# Altium schematic sheet 瓦力驱动主控原理图.SchDoc
size A2
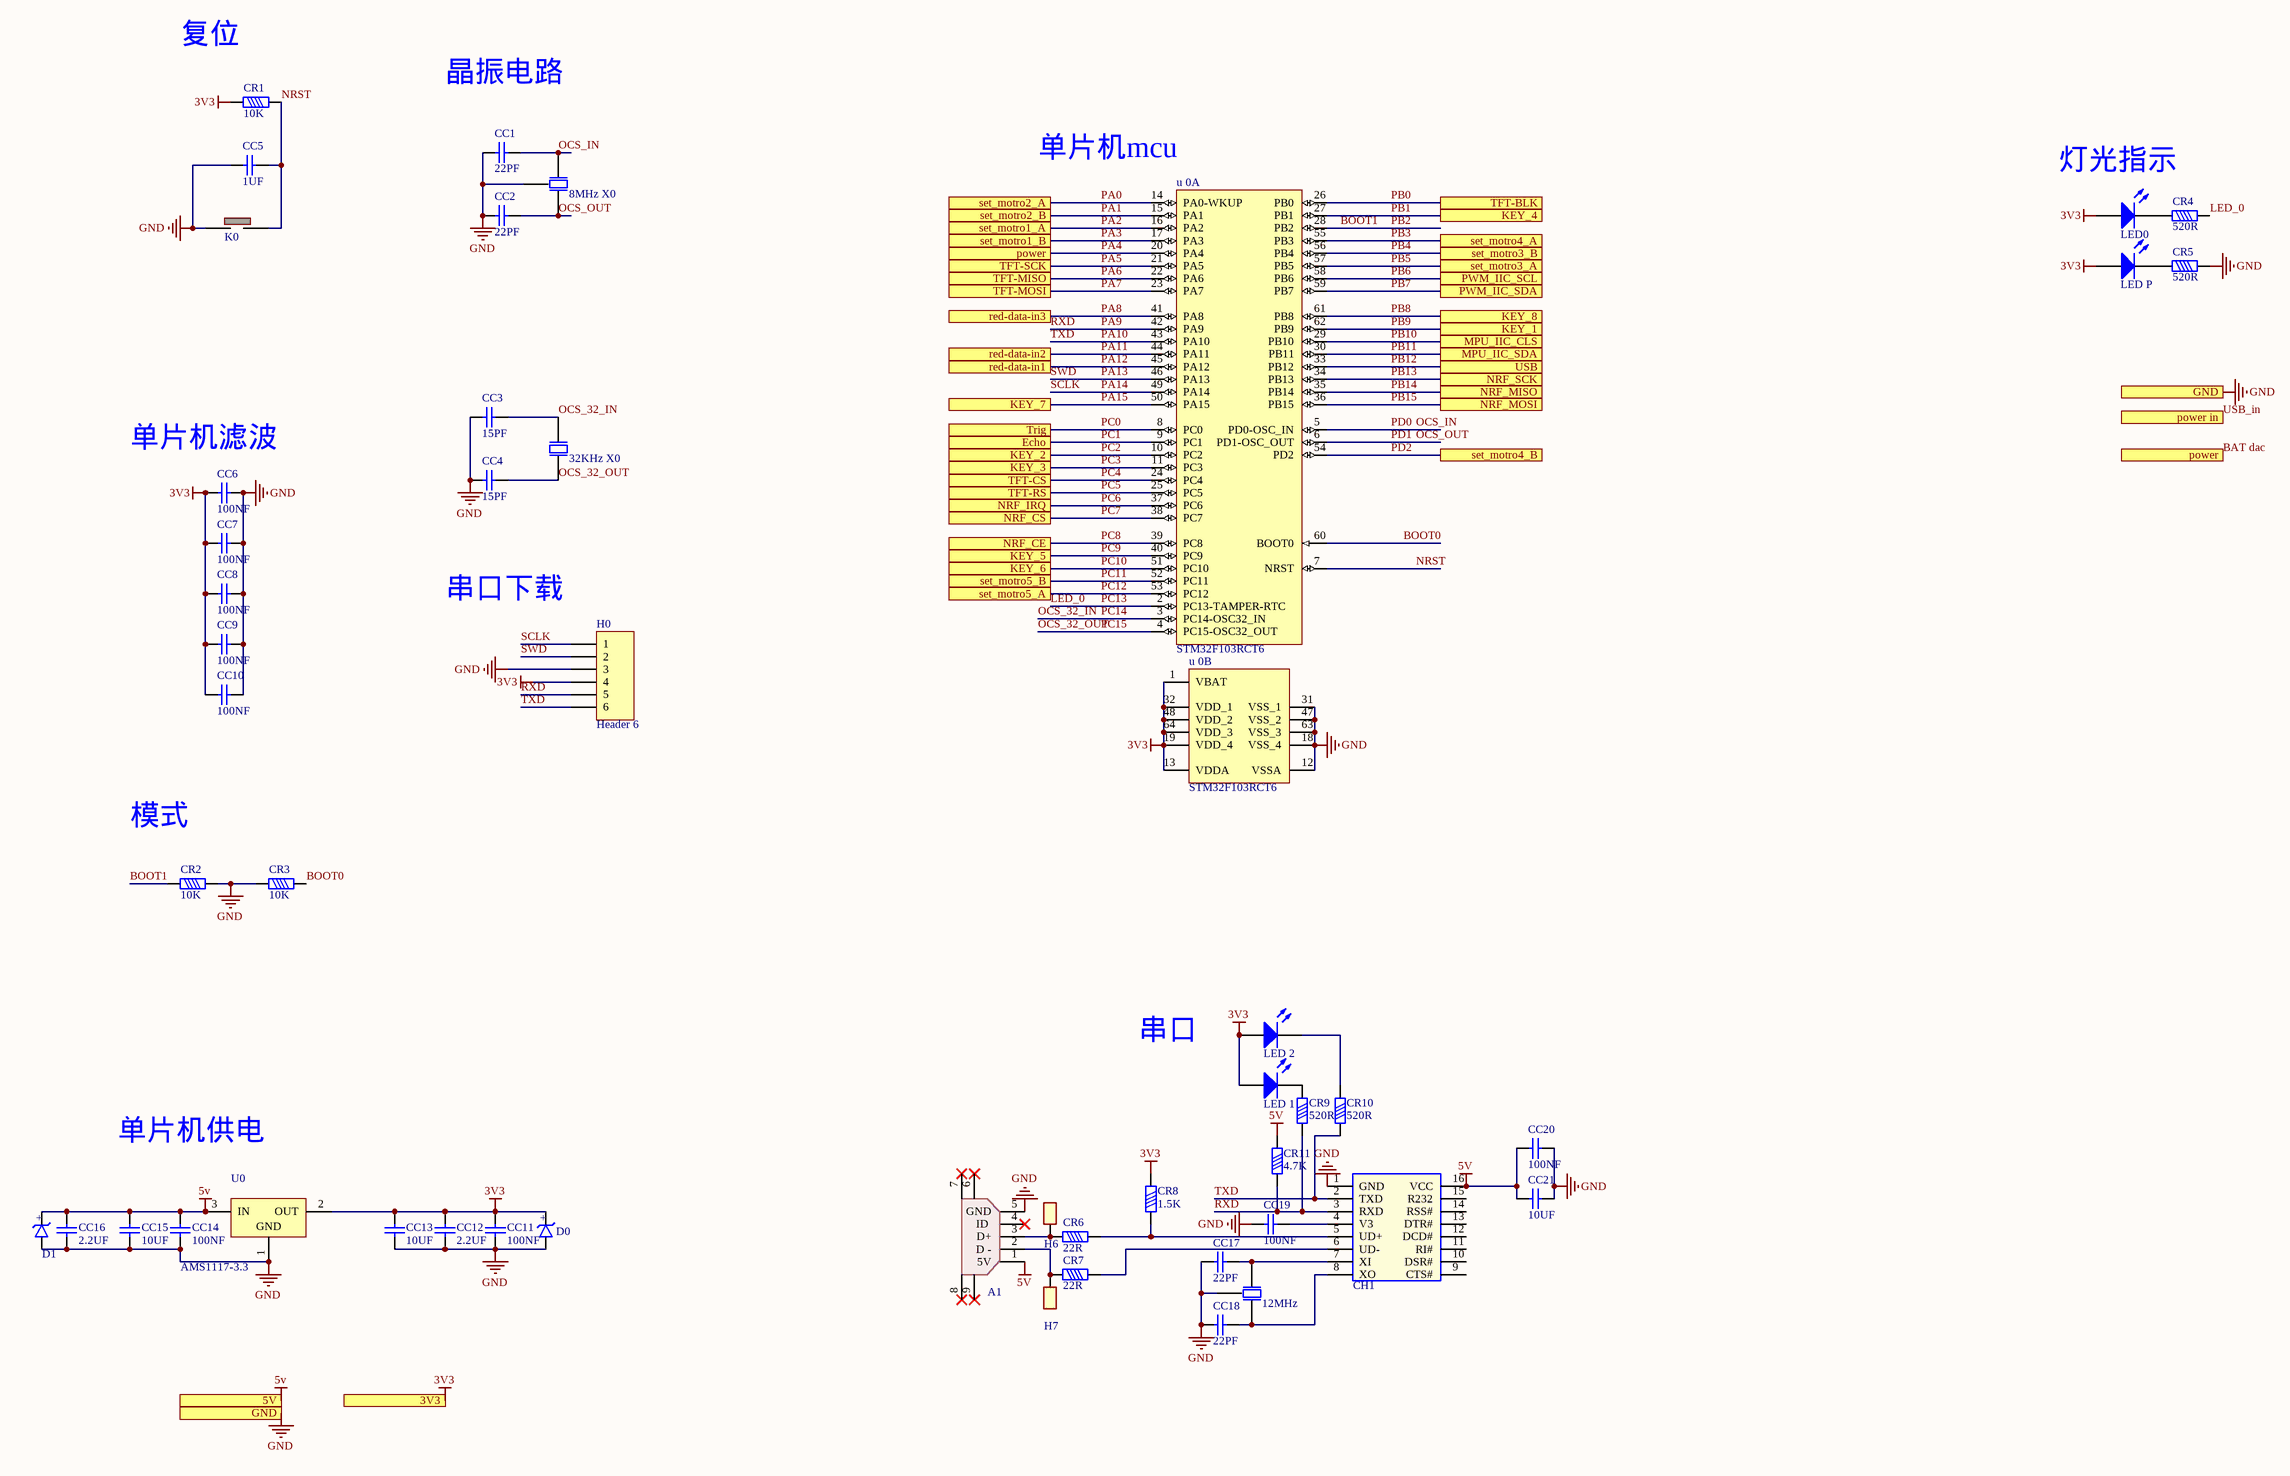
[diagram p0: 瓦力驱动主控原理图.SchDoc]

## Parts
8MHz_X0  XTAL 3225 8M  [T 3225]  (value not drawn)
12MHz  XTAL 3225 8M  [T 3225]  (value not drawn)
32KHz_X0  XTAL 3215 32.768kKHz  [T 3215]  (value not drawn)
A1  Micro USB  [Micro USB]  (value not drawn)
CC1  value 22PF  [CC1608-0603]  (hidden comment: Cap Chip 0603)
CC2  value 22PF  [CC1608-0603]  (hidden comment: Cap Chip 0603)
CC3  value 15PF  [CC1608-0603]  (hidden comment: Cap Chip 0603)
CC4  value 15PF  [CC1608-0603]  (hidden comment: Cap Chip 0603)
CC5  value 1UF  [CC1608-0603]  (hidden comment: Cap Chip 0603)
CC6  value 100NF  [CC1608-0603]  (hidden comment: Cap Chip 0603)
CC7  value 100NF  [CC1608-0603]  (hidden comment: Cap Chip 0603)
CC8  value 100NF  [CC1608-0603]  (hidden comment: Cap Chip 0603)
CC9  value 100NF  [CC1608-0603]  (hidden comment: Cap Chip 0603)
CC10  value 100NF  [CC1608-0603]  (hidden comment: Cap Chip 0603)
CC11  value 100NF  [CC1608-0603]  (hidden comment: Cap Chip 0603)
CC12  value 2.2UF  [CC1608-0603]  (hidden comment: Cap Chip 0603)
CC13  value 10UF  [CC1608-0603]  (hidden comment: Cap Chip 0603)
CC14  value 100NF  [CC1608-0603]  (hidden comment: Cap Chip 0603)
CC15  value 10UF  [CC1608-0603]  (hidden comment: Cap Chip 0603)
CC16  value 2.2UF  [CC1608-0603]  (hidden comment: Cap Chip 0603)
CC17  value 22PF  [CC1608-0603]  (hidden comment: Cap Chip 0603)
CC18  value 22PF  [CC1608-0603]  (hidden comment: Cap Chip 0603)
CC19  value 100NF  [CC1608-0603]  (hidden comment: Cap Chip 0603)
CC20  value 100NF  [CC1608-0603]  (hidden comment: Cap Chip 0603)
CC21  value 10UF  [CC1608-0603]  (hidden comment: Cap Chip 0603)
CH1  CH340G  [SOP16]  (value not drawn)
CR1  value 10K  [CR1608-0603]  (hidden comment: Resistor Chip 0603)
CR2  value 10K  [CR1608-0603]  (hidden comment: Resistor Chip 0603)
CR3  value 10K  [CR1608-0603]  (hidden comment: Resistor Chip 0603)
CR4  value 520R  [CR1608-0603]  (hidden comment: Resistor Chip 0603)
CR5  value 520R  [CR1608-0603]  (hidden comment: Resistor Chip 0603)
CR6  value 22R  [CR1608-0603]  (hidden comment: Resistor Chip 0603)
CR7  value 22R  [CR1608-0603]  (hidden comment: Resistor Chip 0603)
CR8  value 1.5K  [CR1608-0603]  (hidden comment: Resistor Chip 0603)
CR9  value 520R  [CR1608-0603]  (hidden comment: Resistor Chip 0603)
CR10  value 520R  [CR1608-0603]  (hidden comment: Resistor Chip 0603)
CR11  value 4.7K  [CR1608-0603]  (hidden comment: Resistor Chip 0603)
D0  SMBJ3.3A  [DO214AA(SMB)]  (value not drawn)
D1  SMBJ3.3A  [DO214AA(SMB)]  (value not drawn)
H0  Header 6  [HDR1X6]
H6  H0  [header 1]  (value not drawn)
H7  H0  [header 1]  (value not drawn)
K0  KEY 3*4  [KEY 3*4]  (value not drawn)
LED0  LED Chip  [CLED1608-0603]  (value not drawn)
LED_1  LED Chip  [CLED1608-0603]  (value not drawn)
LED_2  LED Chip  [CLED1608-0603]  (value not drawn)
LED_P  LED Chip  [CLED1608-0603]  (value not drawn)
U0  AMS1117-3.3  [SOT-223]
u_0  STM32F103RCT6  [STM-LQFP64_N]  (parts A,B of 2)

## Ports
3V3, 5V, Echo, GND, KEY_1, KEY_2, KEY_3, KEY_4, KEY_5, KEY_6, KEY_7, KEY_8, MPU_IIC_CLS, MPU_IIC_SDA, NRF_CE, NRF_CS, NRF_IRQ, NRF_MISO, NRF_MOSI, NRF_SCK, power, power in, PWM_IIC_SCL, PWM_IIC_SDA, red-data-in1, red-data-in2, red-data-in3, set_motro1_A, set_motro1_B, set_motro2_A, set_motro2_B, set_motro3_A, set_motro3_B, set_motro4_A, set_motro4_B, set_motro5_A, set_motro5_B, TFT-BLK, TFT-CS, TFT-MISO, TFT-MOSI, TFT-RS, TFT-SCK, Trig, USB

## Nets
3V3: CC6.1 CC7.1 CC8.1 CC9.1 CC10.1 CC11.2 CC12.2 CC13.2 CR1.1 CR8.2 D0.1 H0.4 LED0.1(A) LED_1.1(A) LED_2.1(A) LED_P.1(A) U0.2(OUT) u_0.1(VBAT) u_0.13(VDDA) u_0.19(VDD_4) u_0.32(VDD_1) u_0.48(VDD_2) u_0.64(VDD_3) ; port 3V3
5v: A1.1(5V) CC14.2 CC15.2 CC16.2 CC20.1 CC21.1 CH1.16(VCC) CR11.2 D1.1 U0.3(IN) ; port 5V
GND: 8MHz_X0.3(GND) 12MHz.3(GND) A1.5(GND) CC1.1 CC2.1 CC3.1 CC4.1 CC5.1 CC6.2 CC7.2 CC8.2 CC9.2 CC10.2 CC11.1 CC12.1 CC13.1 CC14.1 CC15.1 CC16.1 CC17.1 CC18.1 CC19.1 CC20.2 CC21.2 CH1.1(GND) CR2.2 CR3.1 CR5.2 D0.2 D1.2 H0.3 K0.1 U0.1(GND) u_0.12(VSSA) u_0.18(VSS_4) u_0.31(VSS_1) u_0.47(VSS_2) u_0.63(VSS_3) ; port GND
BAT dac: u_0.20(PA4) ; port power  [also labelled PA4]
BOOT0: CR3.2 u_0.60(BOOT0)
BOOT1: CR2.1 u_0.28(PB2)  [also labelled PB2]
LED_0: CR4.2 u_0.2(PC13-TAMPER-RTC)  [also labelled PC13]
NRST: CC5.2 CR1.2 K0.2 u_0.7(NRST)
OCS_32_IN: 32KHz_X0.2(OSC2) CC3.2 u_0.3(PC14-OSC32_IN)  [also labelled PC14]
OCS_32_OUT: 32KHz_X0.1(OSC1) CC4.2 u_0.4(PC15-OSC32_OUT)  [also labelled PC15]
OCS_IN: 8MHz_X0.1(OSC1) CC1.2 u_0.5(PD0-OSC_IN)  [also labelled PD0]
OCS_OUT: 8MHz_X0.2(OSC2) CC2.2 u_0.6(PD1-OSC_OUT)  [also labelled PD1]
PA0: u_0.14(PA0-WKUP) ; port set_motro2_A
PA1: u_0.15(PA1) ; port set_motro2_B
PA2: u_0.16(PA2) ; port set_motro1_A
PA3: u_0.17(PA3) ; port set_motro1_B
PA~{5}: u_0.21(PA5) ; port TFT-SCK
PA6: u_0.22(PA6) ; port TFT-MISO
PA7: u_0.23(PA7) ; port TFT-MOSI
PA8: u_0.41(PA8) ; port red-data-in3
PA9: CH1.3(RXD) CR9.1 CR11.1 H0.5 u_0.42(PA9)  [also labelled RXD]
PA10: CH1.2(TXD) CR10.1 H0.6 u_0.43(PA10)  [also labelled TXD]
PA11: u_0.44(PA11) ; port red-data-in2
PA12: u_0.45(PA12) ; port red-data-in1
PA13: H0.2 u_0.46(PA13)  [also labelled SWD]
PA14: H0.1 u_0.49(PA14)  [also labelled SCLK]
PA15: u_0.50(PA15) ; port KEY_7
PB0: u_0.26(PB0) ; port TFT-BLK
PB1: u_0.27(PB1) ; port KEY_4
PB3: u_0.55(PB3) ; port set_motro4_A
PB4: u_0.56(PB4) ; port set_motro3_B
PB5: u_0.57(PB5) ; port set_motro3_A
PB6: u_0.58(PB6) ; port PWM_IIC_SCL
PB7: u_0.59(PB7) ; port PWM_IIC_SDA
PB8: u_0.61(PB8) ; port KEY_8
PB9: u_0.62(PB9) ; port KEY_1
PB10: u_0.29(PB10) ; port MPU_IIC_CLS
PB11: u_0.30(PB11) ; port MPU_IIC_SDA
PB12: u_0.33(PB12) ; port USB
PB13: u_0.34(PB13) ; port NRF_SCK
PB14: u_0.35(PB14) ; port NRF_MISO
PB15: u_0.36(PB15) ; port NRF_MOSI
PC0: u_0.8(PC0) ; port Trig
PC1: u_0.9(PC1) ; port Echo
PC2: u_0.10(PC2) ; port KEY_2
PC3: u_0.11(PC3) ; port KEY_3
PC4: u_0.24(PC4) ; port TFT-CS
PC5: u_0.25(PC5) ; port TFT-RS
PC6: u_0.37(PC6) ; port NRF_IRQ
PC7: u_0.38(PC7) ; port NRF_CS
PC8: u_0.39(PC8) ; port NRF_CE
PC9: u_0.40(PC9) ; port KEY_5
PC10: u_0.51(PC10) ; port KEY_6
PC11: u_0.52(PC11) ; port set_motro5_B
PC12: u_0.53(PC12) ; port set_motro5_A
PD2: u_0.54(PD2) ; port set_motro4_B
USB_in: port power in
Net12MHz_1: 12MHz.1(OSC1) CC17.2 CH1.7(XI)
Net12MHz_2: 12MHz.2(OSC2) CC18.2 CH1.8(XO)
NetA1_2: A1.2(D_-) CR7.1 H7.1
NetA1_3: A1.3(D+) CR6.1 H6.1
NetCC19_2: CC19.2 CH1.4(V3)
NetCH1_5: CH1.5(UD+) CR6.2 CR8.1
NetCH1_6: CH1.6(UD-) CR7.2
NetCR4_1: CR4.1 LED0.2(K)
NetCR5_1: CR5.1 LED_P.2(K)
NetCR9_2: CR9.2 LED_1.2(K)
NetCR10_2: CR10.2 LED_2.2(K)

Not connected (* = marked no-connect by the designer): A1 4(ID_)* 6* 7* 8* 9*; CH1 9(CTS#) 10(DSR#) 11(RI#) 12(DCD#) 13(DTR#) 14(RSS#) 15(R232)

## Notes on the sheet
- 复位
- 晶振电路
- 单片机mcu
- (near LED0) 灯光指示
- (near CC6) 单片机滤波
- 串口下载
- 模式
- 串口
- 单片机供电
- (in symbol SMBJ3.3A) +

## Library data of the parts
CC1-CC21 = Cap Chip 0603: Polarized Capacitor (Radial); Published: 8-Jun-2000; Revision: July-2002: Re-released for DXP Platform.; Publisher: Altium Limited
CH1 = CH340G: 串口转USB
CR1-CR11 = Resistor Chip 0603: Resistor; Published: 8-Jun-2000; Revision: July-2002: Re-released for DXP Platform.; Publisher: Altium Limited
D0 D1 = SMBJ3.3A: 3.3V稳压管，缓解瞬间电压冲击
H0 = Header 6: Header, 6-Pin; LatestRevisionDate: 17-Jul-2002; LatestRevisionNote: Re-released for DXP Platform.; Publisher: Altium Limited
H6 H7 = header 1
LED0 LED_1 LED_2 LED_P = LED Chip: Typical Chip LED; Published: 8-Jun-2000; Revision: July-2002: Re-released for DXP Platform.; Publisher: Altium Limited
U0 = AMS1117: POSITIVE OUTPUT VOLTAGE
u_0 = STM32F103RCT6: ARM Cortex-M3 32-bit MCU, 256 KB Flash, 48 KB Internal RAM, 51 I/Os, 64-pin LQFP, -40 to 85 degC, Tray; A/D Converter: 3x12-bit (16 Channel); D/A Converter: 2x12-bit (2 Channel); FLASH Size (Prog) (kB): 256; I/Os (High Current): 51; Internal RAM Size (kB): 48; Operating Frequency(F) (Processor speed) (MHz): 72; Supply Voltage(Vcc) min (V): 2; DatasheetVersion: Rev. 8; PackageVersion: Rev. 4, 06/2013; PackageReference: LQFP64; PackageDescription: 64-Pin Low Profile Quad Flat Package, 10 x 10 mm Body, 0.5 mm Pitch; Supplier 1: Digi-Key; Supplier Part Number 1: 497-9033-ND; Supplier 2: Newark; Supplier Part Number 2: 01P4099; Supplier 3: Newark; Supplier Part Number 3: 57P1227; Supplier 4: Mouser; Supplier Part Number 4: 511-STM32F103RCT6; Core: ARM Cortex-M3; Packing: Tray; Mounting Technology: Surface Mount; PartNumber: STM32F103RCT6; ComponentLink1Description: Manufacturer URL; ComponentLink1URL: http://www.st.com/web/en/home.html; ComponentLink2Description: Datasheet; ComponentLink2URL: http://www.st.com/st-web-ui/static/active/en/resource/technical/document/datasheet/CD00191185.pdf; ComponentLink3Description: Package Specification; ComponentLink3URL: http://www.st.com/st-web-ui/static/active/en/resource/technical/document/datasheet/DM00037051.pdf